# EAGLE design Prism (EAGLE 8.1.1)
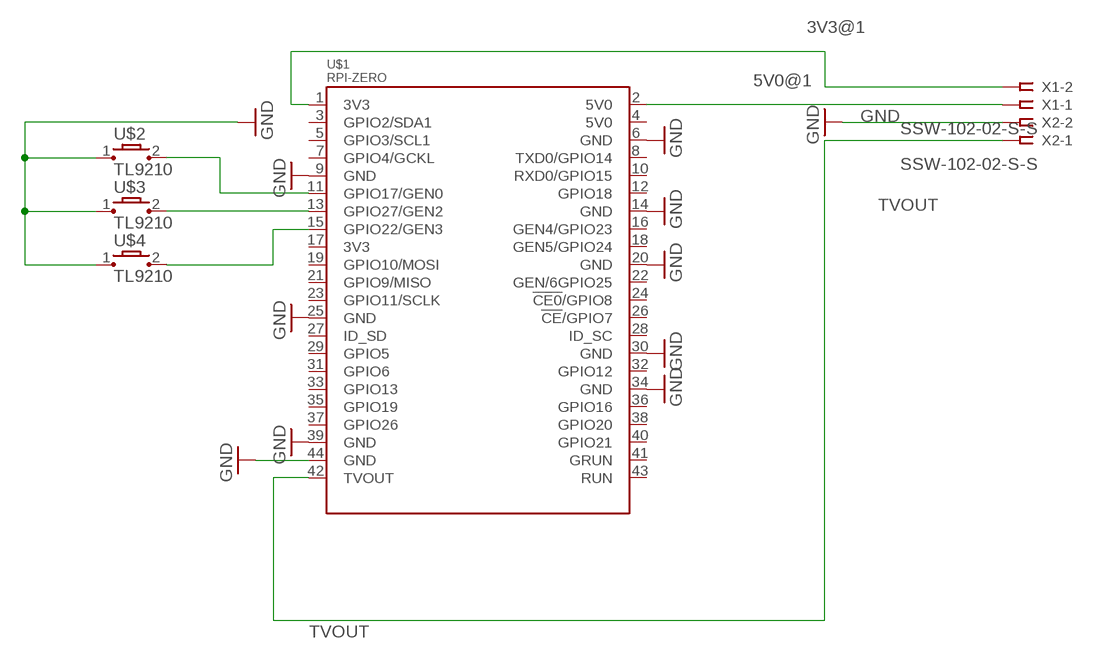
[diagram p0: schematic, sheet 1]

## Parts
U$1  RPI-ZERO  [RASPBERRYPI_BASTELSTUBE_V13_RASPI_BOARD_B+_FULL]
U$2  TL9210  [TL9210]
U$3  TL9210  [TL9210]
U$4  TL9210  [TL9210]
X1  SSW-102-02-S-S  [SSW-102-02-S-S]
X2  SSW-102-02-S-S  [SSW-102-02-S-S]

## Nets
3V3@1: U$1.1(3V3) X1.2
5V0@1: U$1.2(5V0) X1.1
GND: U$1.6(GND) U$1.9(GND) U$1.14(GND) U$1.20(GND) U$1.25(GND) U$1.30(GND) U$1.34(GND) U$1.39(GND) U$1.44(GND) U$2.1 U$3.1 U$4.1 X2.2
N$2: U$1.11(GPIO17/GEN0) U$2.2
N$3: U$1.13(GPIO27/GEN2) U$3.2
N$4: U$1.15(GPIO22/GEN3) U$4.2
TVOUT: U$1.42(TVOUT) X2.1
Unconnected: U$1.3(GPIO2/SDA1) U$1.4(5V0) U$1.5(GPIO3/SCL1) U$1.7(GPIO4/GCKL) U$1.8(TXD0/GPIO14) U$1.10(RXD0/GPIO15) U$1.12(GPIO18) U$1.16(GEN4/GPIO23) U$1.17(3V3) U$1.18(GEN5/GPIO24) U$1.19(GPIO10/MOSI) U$1.21(GPIO9/MISO) U$1.22(GEN/6GPIO25) U$1.23(GPIO11/SCLK) U$1.24(!CE0!/GPIO8) U$1.26(!CE!/GPIO7) U$1.27(ID_SD) U$1.28(ID_SC) U$1.29(GPIO5) U$1.31(GPIO6) U$1.32(GPIO12) U$1.33(GPIO13) U$1.35(GPIO19) U$1.36(GPIO16) U$1.37(GPIO26) U$1.38(GPIO20) U$1.40(GPIO21) U$1.41(GRUN) U$1.43(RUN)

## Library data of the parts
U$1 = RPI-Zero:RPI-ZERO
U$2-U$4 = TL9210:TL9210
X1 X2 = con-samtec:SSW-102-02-S-S: THROUGH-HOLE .025" SQ POST SOCKET Source: Samtec SSW.pdf; MPN: SSW-102-02-S-S; OC_FARNELL: unknown; OC_NEWARK: 11P9351

## Board
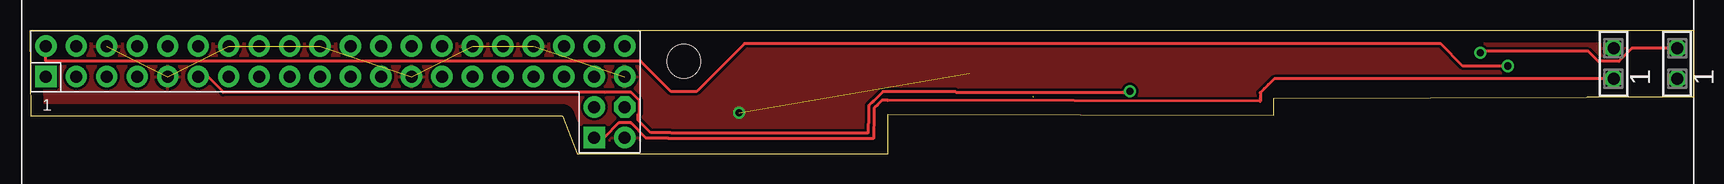
[diagram p1: board, top side]
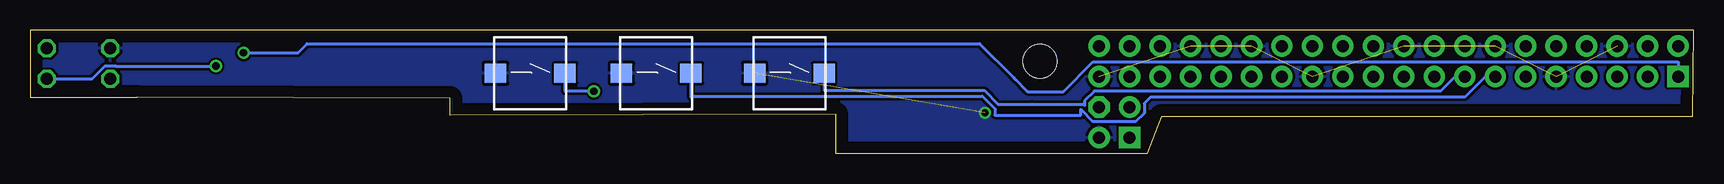
[diagram p2: board, bottom side, seen from below]

Size 138.7 x 10.3 mm. Coordinates in mm from the lower left corner, seen from the top.
Outline: 44.4,3.1 45.6,0 71.5,0 71.5,3.3 103.7,3.2 103.7,4.6 129.75,4.7 138.7,4.7 138.7,10.3 0,10.3 0.1,3.1 44.4,3.1
Copper layers (1*16): Top 0.035mm / dielectric 1.5mm / Bottom 0.035mm
Design rules "default": minimum track width 10mil, minimum drill 24mil, track to track 8mil, track to pad 8mil, pad to pad 8mil, via to via 8mil, smd to smd 8mil, copper to edge 40mil, drill to drill 8mil, minimum pad ring 10mil, minimum via ring 8mil, stop-mask expansion 4mil, vias tented up to drill 0mil, thermal gap 10mil
Holes 2.8 mm at 54.5,7.7

### Footprints (pad centres in the part's own frame; a part is rotated, then mirrored left to right if it is on the bottom)
RASPBERRYPI_BASTELSTUBE_V13_RASPI_BOARD_B+_FULL = drill 1 pad 1.778 square: 1 8.37,25.23; 42 54.09,20.15 | drill 1 pad 1.778: 2 8.37,27.77; 3 10.91,25.23; 4 10.91,27.77; 5 13.45,25.23; 6 13.45,27.77; 7 15.99,25.23; 8 15.99,27.77; 9 18.53,25.23; 10 18.53,27.77; 11 21.07,25.23; 12 21.07,27.77; 13 23.61,25.23; 14 23.61,27.77; 15 26.15,25.23; 16 26.15,27.77; 17 28.69,25.23; 18 28.69,27.77; 19 31.23,25.23; 20 31.23,27.77; 21 33.77,25.23; 22 33.77,27.77; 23 36.31,25.23; 24 36.31,27.77; 25 38.85,25.23; 26 38.85,27.77; 27 41.39,25.23; 28 41.39,27.77; 29 43.93,25.23; 30 43.93,27.77; 31 46.47,25.23; 32 46.47,27.77; 33 49.01,25.23; 34 49.01,27.77; 35 51.55,25.23; 36 51.55,27.77; 37 54.09,25.23; 38 54.09,27.77; 39 56.63,25.23; 40 56.63,27.77; 41 54.09,22.69; 44 56.63,20.15 | drill 1 pad 1.778 octagon: 43 56.63,22.69
TL9210 = smd 1.8 x 1.6: 1 -2.9,0; 2 2.9,0
SSW-102-02-S-S = drill 1 pad 1.5 octagon: 1 -1.27,0; 2 1.27,0

### Placement (x,y rotation side)
U$1  -7.05,-18.81 0 top
U$2  97,6.7 0 bottom
U$3  86.5,6.7 0 bottom
U$4  75.4,6.7 0 bottom
X1  137.3,7.5 90 top
X2  132,7.5 90 top

### Tracks (layer width: path | path; a pad name or v marks a point on that pad's centre or on a via)
3V3@1  (via drill 0.6)
  Top 0.254: X1.2 133.53,8.77 132.45,7.69 130.74,7.69 129.9,8.52 120.9,8.52 v120.9,8.4
  Bottom 0.254: v120.9,8.4 116.36,8.4 115.6,9.16 59.55,9.16 56.7,6.3 | 56.55,6.15 56.7,6.3 | 56.7,6.3 55.55,5.16 52.57,5.16 50.09,7.64 1.32,7.64 U$1.1
5V0@1  (via drill 0.6)
  Top 0.254: U$1.2 1.32,7.7 50.9,7.7 53.45,5.16 55.55,5.16 59.55,9.16 117.6,9.16 119.46,7.3 v123.2,7.3
  Bottom 0.254: X1.1 133.53,6.23 132.45,7.31 131.55,7.31 131.54,7.3 v123.2,7.3
GND  (via drill 0.6)  (8 unrouted)
  other vias: 59.1,3.4
  pour Top: 197.9,23.3 198.1,-9 -1.3,-11.5 -7.9,21.4 197.9,23.4
  pour Bottom: 198.8,23.7 199,-8.6 -2,-11.7 -8.2,21.7 198.8,23.8
N$2  (via drill 0.6)
  Top 0.254: U$1.11 14.84,6.42 16.1,5.16 16.1,5.1 47.9,5.1 50.09,5.1 50.8,4.39 50.8,3.38 50.7,3.28 50.7,2.8 51.74,1.76 53.39,1.76 53.45,1.7 69.85,1.7 69.9,3.33 69.9,3.59 | v91.7,5.2 91.7,5.1 77.2,5.1 77.14,5.16 71.09,5.16 70.3,4.37 70.2,4.27 70.19,4.26 69.92,4.01 | 69.92,4.01 | 69.92,4.01 | 69.92,4.01 69.92,3.99 69.9,3.97 | 69.9,3.97 | 69.9,3.97 | 69.9,3.97 69.9,3.74 69.9,3.59 | 69.9,3.59
  Bottom 0.254: v91.7,5.2 94.1,5.2 U$2.2
N$3  (1 unrouted)
  Bottom 0.254: U$1.13 17.38,6.42 19.1,4.7 45.3,4.7 45.82,4.18 45.82,3.38 46.54,2.66 50.09,2.66 51.1,3.68 51.1,3.2 58.27,3.2 58.27,3.75 59.32,4.8 83.6,4.8 | 83.6,4.7 U$3.2
N$4
  Bottom 0.254: U$1.15 19.92,6.42 21.13,5.2 49.98,5.2 50.8,4.39 50.8,4.02 50.91,4.13 55.18,4.13 55.18,4.12 58,4.12 59.14,5.27 72.5,5.27 U$4.2
TVOUT
  Top 0.254: 102.56,4.35 102.56,4.6 102.55,5.07 102.56,5.07 102.89,5.41 103.22,5.74 103.71,6.23 X2.1 | 102.56,4.35 | 102.56,4.35 71.52,4.44 71.06,4.46 71.05,4.44 71.03,4.44 70.71,4.12 70.37,3.81 70.37,3.79 70.36,3.78 70.36,3.32 70.29,1.24 53.2,1.24 53.2,1.3 51.34,1.3 50.09,2.56 49.08,2.56 47.86,1.34 U$1.42